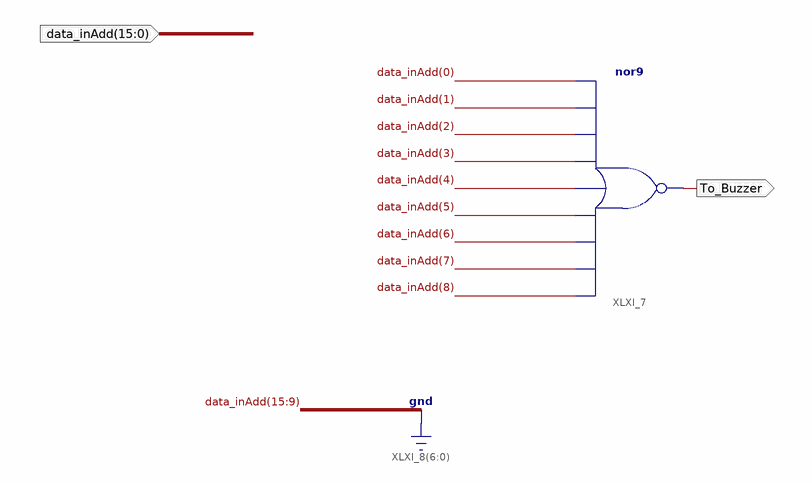
[diagram p0: schematic sheet 1]
// Xilinx ISE schematic Comparator.sch (spartan6) as structural Verilog: 1 symbols, 2 ports
module Comparator (
  input  [15:0] data_inAdd,
  output To_Buzzer
);

  nor XLXI_7 (To_Buzzer, data_inAdd[8], data_inAdd[7], data_inAdd[6], data_inAdd[5], data_inAdd[4], data_inAdd[3], data_inAdd[2], data_inAdd[1], data_inAdd[0]);
  // also tied to GND on the sheet: {data_inAdd[9], data_inAdd[10], data_inAdd[11], data_inAdd[12], data_inAdd[13], data_inAdd[14], data_inAdd[15]}
endmodule
